# EAGLE design LoadSwitch (EAGLE 9.3.1)
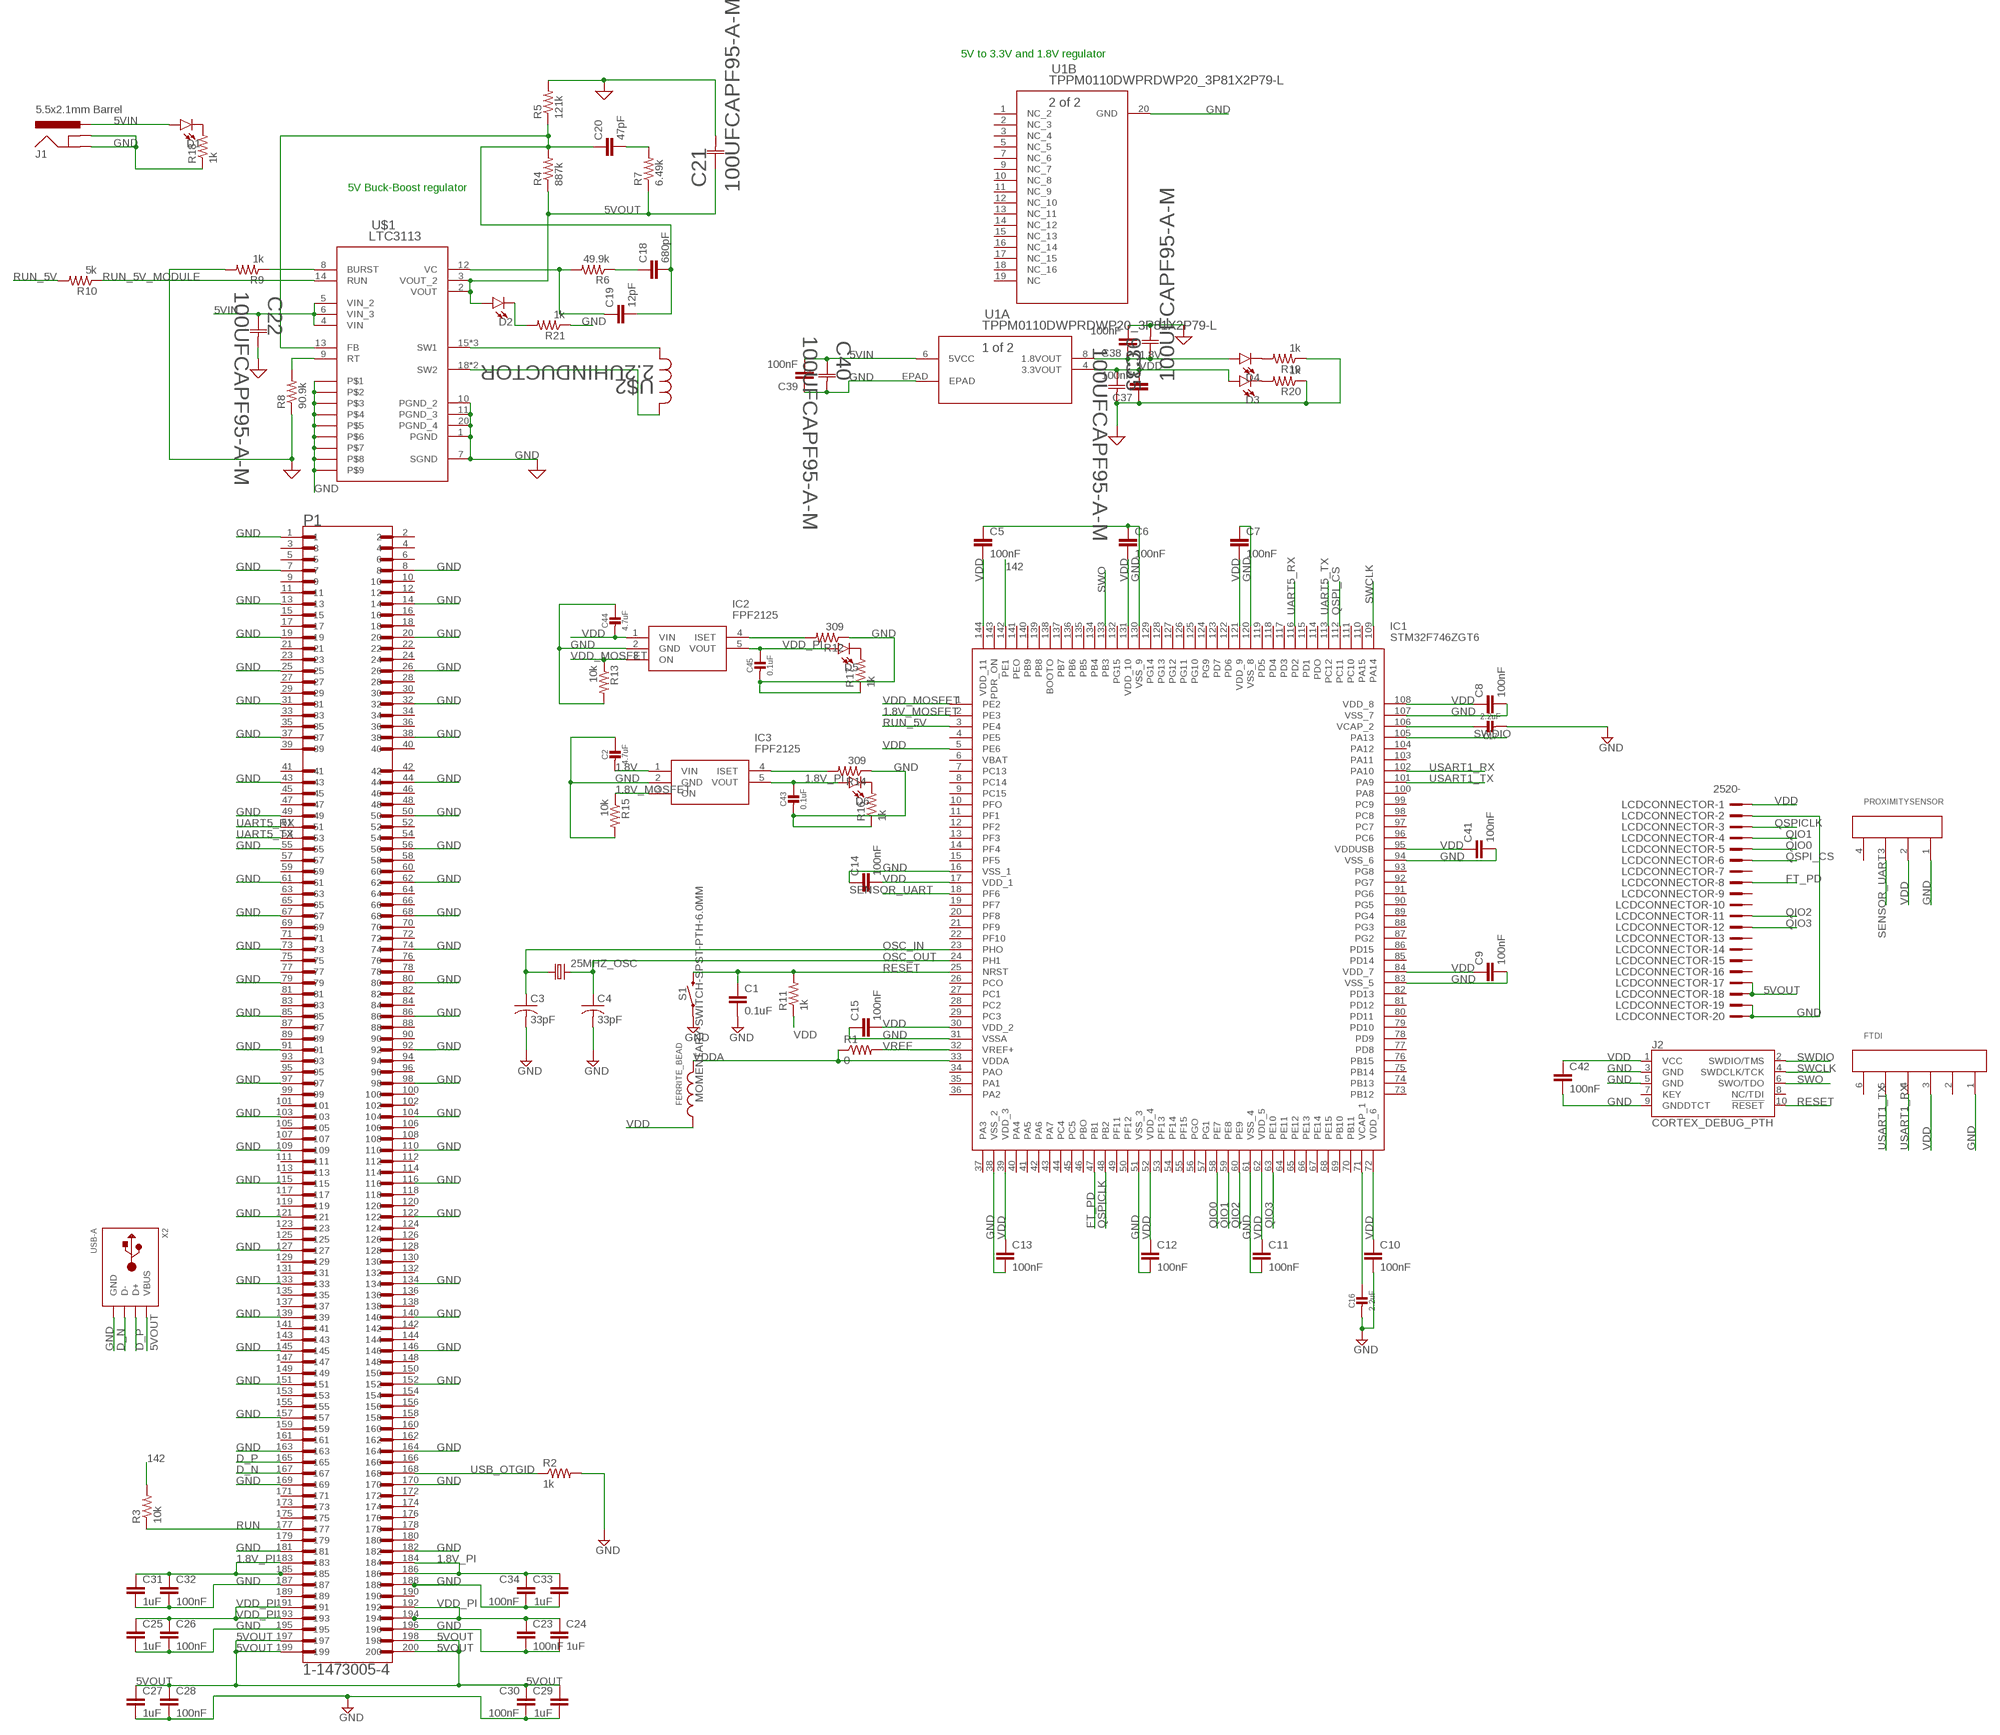
[diagram p0: schematic, sheet 1]

## Parts
25MHZ_OSC  CRYSTALHC49UP  [HC49UP]
C1  0.1uF  C-EUC0805  [C0805]
C2  4.7uF  CAP_CERAMIC0805-NOOUTLINE  [0805-NO]
C3  33pF  C-USC0805  [C0805]
C4  33pF  C-USC0805  [C0805]
C5  100nF  C-EUC0805  [C0805]
C6  100nF  C-EUC0805  [C0805]
C7  100nF  C-EUC0805  [C0805]
C8  100nF  C-EUC0805  [C0805]
C9  100nF  C-EUC0805  [C0805]
C10  100nF  C-EUC0805  [C0805]
C11  100nF  C-EUC0805  [C0805]
C12  100nF  C-EUC0805  [C0805]
C13  100nF  C-EUC0805  [C0805]
C14  100nF  C-EUC0805  [C0805]
C15  100nF  C-EUC0805  [C0805]
C16  2.2uF  CAP_CERAMIC0805-NOOUTLINE  [0805-NO]
C17  2.2uF  CAP_CERAMIC0805-NOOUTLINE  [0805-NO]
C18  680pF  C-EUC0805  [C0805]
C19  12pF  C-EUC0805  [C0805]
C20  47pF  C-EUC0805  [C0805]
C21  100UFCAPF95-A-M  [F95-A-M]
C22  100UFCAPF95-A-M  [F95-A-M]
C23  100nF  C-EUC0805  [C0805]
C24  1uF  C-EUC0805  [C0805]
C25  1uF  C-EUC0805  [C0805]
C26  100nF  C-EUC0805  [C0805]
C27  1uF  C-EUC0805  [C0805]
C28  100nF  C-EUC0805  [C0805]
C29  1uF  C-EUC0805  [C0805]
C30  100nF  C-EUC0805  [C0805]
C31  1uF  C-EUC0805  [C0805]
C32  100nF  C-EUC0805  [C0805]
C33  1uF  C-EUC0805  [C0805]
C34  100nF  C-EUC0805  [C0805]
C35  100UFCAPF95-A-M  [F95-A-M]
C36  100UFCAPF95-A-M  [F95-A-M]
C37  100nF  C-EUC0805  [C0805]
C38  100nF  C-EUC0805  [C0805]
C39  100nF  C-EUC0805  [C0805]
C40  100UFCAPF95-A-M  [F95-A-M]
C41  100nF  C-EUC0805  [C0805]
C42  100nF  C-EUC0805  [C0805]
C43  0.1uF  CAP_CERAMIC0805-NOOUTLINE  [0805-NO]
C44  4.7uF  CAP_CERAMIC0805-NOOUTLINE  [0805-NO]
C45  0.1uF  CAP_CERAMIC0805-NOOUTLINE  [0805-NO]
D1  LED0603  [LED-0603]
D2  LED0603  [LED-0603]
D3  LED0603  [LED-0603]
D4  LED0603  [LED-0603]
D5  LED0603  [LED-0603]
D6  LED0603  [LED-0603]
FERRITE_BEAD  WE-CBA_0805_782853112_HC  [WE-CBA_0805(W=4)]
FTDI  66100611622  [66100611622]
IC1  STM32F746ZGT6  [QFP50P2200X2200X160-144N]
IC2  FPF2125  [SOT95P280X140-5N]
IC3  FPF2125  [SOT95P280X140-5N]
J1  5.5x2.1mm Barrel  POWER_JACKSMD  [POWER_JACK_SMD]
J2  CORTEX_DEBUG_PTH  [2X5-PTH-1.27MM]
LCDCONNECTOR  2520-  [PAK100/2500-20]
P1  1-1473005-4  [TE_1-1473005-4]
PROXIMITYSENSOR  66100411622  [66100411622]
R1  0  R-US_R0805  [R0805]
R2  1k  R-US_R0805  [R0805]
R3  10k  R-US_R0805  [R0805]
R4  887k  R-US_R0805  [R0805]
R5  121k  R-US_R0805  [R0805]
R6  49.9k  R-US_R0805  [R0805]
R7  6.49k  R-US_R0805  [R0805]
R8  90.9k  R-US_R0805  [R0805]
R9  1k  R-US_R0805  [R0805]
R10  5k  R-US_R0805  [R0805]
R11  1k  R-US_R0805  [R0805]
R12  309  R-US_R0805  [R0805]
R13  10k  R-US_R0805  [R0805]
R14  309  R-US_R0805  [R0805]
R15  10k  R-US_R0805  [R0805]
R16  1k  R-US_R0805  [R0805]
R17  1k  R-US_R0805  [R0805]
R18  1k  R-US_R0805  [R0805]
R19  1k  R-US_R0805  [R0805]
R20  1k  R-US_R0805  [R0805]
R21  1k  R-US_R0805  [R0805]
S1  MOMENTARY-SWITCH-SPST-PTH-6.0MM  [TACTILE_SWITCH_PTH_6.0MM]
U1  TPPM0110DWPRDWP20_3P81X2P79-L  [DWP20_3P81X2P79-L]
U$1  LTC3113  [TSSOP-20_FE/CA]
U$2  2.2UHINDUCTOR  [IND_10040]
X2  USB-A  [MOLEX_480371000]

## Nets
1.8V: C2.2 C36.1 C38.1 D4.A IC3.1(VIN) U1.8(A:1.8VOUT)
1.8V_MOSFET: IC1.2(PE3) IC3.3(ON) R15.1
1.8V_PI: C31.1 C32.1 C33.1 C34.1 C43.1 D6.A IC3.5(VOUT) P1.183 P1.184 P1.185 P1.186
5VIN: C22.1 C39.2 C40.1 D1.A J1.VIN0(PWR) U1.6(A:5VCC) U$1.4(VIN) U$1.5(VIN_2) U$1.6(VIN_3)
5VOUT: C21.1 C27.1 C28.1 C29.1 C30.1 D2.A LCDCONNECTOR.17 LCDCONNECTOR.18 P1.197 P1.198 P1.199 P1.200 R4.1 R7.1 U$1.2(VOUT) U$1.3(VOUT_2) X2.1(VBUS)
142: IC1.142(PE1) R3.2
D_N [D]: P1.167 X2.2(D-)
D_P [D]: P1.165 X2.3(D+)
FT_PD: IC1.47(PB1) LCDCONNECTOR.8
GND: C1.2 C2.1 C3.2 C4.2 C5.1 C6.1 C7.1 C8.2 C9.2 C10.2 C11.2 C12.2 C13.2 C14.1 C15.1 C16.2 C17.2 C21.2 C22.2 C23.2 C24.2 C25.2 C26.2 C27.2 C28.2 C29.2 C30.2 C31.2 C32.2 C33.2 C34.2 C35.2 C36.2 C37.1 C38.2 C39.1 C40.2 C41.2 C42.2 C43.2 C44.1 C45.2 FTDI.1 IC1.16(VSS_1) IC1.31(VSSA) IC1.38(VSS_2) IC1.51(VSS_3) IC1.61(VSS_4) IC1.83(VSS_5) IC1.94(VSS_6) IC1.107(VSS_7) IC1.120(VSS_8) IC1.130(VSS_9) IC2.2(GND) IC3.2(GND) J1.GND(GNDBREAK) J1.P$4(GND) J2.3(GND) J2.5(GND) J2.9(GNDDTCT) LCDCONNECTOR.2 LCDCONNECTOR.19 LCDCONNECTOR.20 P1.1 P1.7 P1.8 P1.13 P1.14 P1.19 P1.20 P1.25 P1.26 P1.31 P1.32 P1.37 P1.38 P1.43 P1.44 P1.49 P1.50 P1.55 P1.56 P1.61 P1.62 P1.67 P1.68 P1.73 P1.74 P1.79 P1.80 P1.85 P1.86 P1.91 P1.92 P1.97 P1.98 P1.103 P1.104 P1.109 P1.110 P1.115 P1.116 P1.121 P1.122 P1.127 P1.133 P1.134 P1.139 P1.140 P1.145 P1.146 P1.151 P1.152 P1.157 P1.163 P1.164 P1.169 P1.170 P1.181 P1.182 P1.187 P1.188 P1.195 P1.196 PROXIMITYSENSOR.1 R2.2 R5.2 R8.1 R9.2 R12.1 R13.2 R14.1 R15.2 R16.1 R17.1 R18.1 R19.1 R20.1 R21.1 S1.1 U1.20(B:GND) U1.EPAD(A:EPAD) U$1.1(PGND) U$1.7(SGND) U$1.10(PGND_2) U$1.11(PGND_3) U$1.20(PGND_4) U$1.P$1 U$1.P$2 U$1.P$3 U$1.P$4 U$1.P$5 U$1.P$6 U$1.P$7 U$1.P$8 U$1.P$9 X2.4(GND) ; supply symbol labelled SUP
N$1: C16.1 IC1.71(VCAP_1)
N$2: C17.1 IC1.106(VCAP_2)
N$3: C20.2 R7.2
N$4: C19.1 R6.2 U$1.12(VC)
N$5: C18.1 R6.1
N$6: C18.2 C19.2 C20.1 R4.2 R5.1 U$1.13(FB)
N$7: U$1.15(SW1) U$1.16(SW1) U$1.17(SW1) U$2.2
N$8: U$1.18(SW2) U$1.19(SW2) U$2.1
N$9: R8.2 U$1.9(RT)
N$10: R9.1 U$1.8(BURST)
N$11: IC3.4(ISET) R14.2
N$12: D6.C R16.2
N$13: D5.C R17.2
N$14: IC2.4(ISET) R12.2
N$15: D1.C R18.2
N$16: D4.C R19.2
N$17: D3.C R20.2
N$18: D2.C R21.2
OSC_IN: 25MHZ_OSC.1 C3.1 IC1.23(PHO)
OSC_OUT: 25MHZ_OSC.2 C4.1 IC1.24(PH1)
QIO0: IC1.58(PE7) LCDCONNECTOR.5
QIO1: IC1.59(PE8) LCDCONNECTOR.4
QIO2: IC1.60(PE9) LCDCONNECTOR.11
QIO3: IC1.63(PE10) LCDCONNECTOR.12
QSPI_CS: IC1.112(PC11) LCDCONNECTOR.6
QSPICLK: IC1.48(PB2) LCDCONNECTOR.3
RESET: C1.1 IC1.25(NRST) J2.10(!RESET) R11.2 S1.3
RUN: P1.177 R3.1
RUN_5V: IC1.3(PE4) R10.2
RUN_5V_MODULE: R10.1 U$1.14(RUN)
SENSOR_UART: IC1.18(PF6) PROXIMITYSENSOR.3
SWCLK: IC1.109(PA14) J2.4(SWDCLK/TCK)
SWDIO: IC1.105(PA13) J2.2(SWDIO/TMS)
SWO: IC1.133(PB3) J2.6(SWO/TDO)
UART5_RX: IC1.116(PD2) P1.51
UART5_TX: IC1.113(PC12) P1.53
USART1_RX: FTDI.4 IC1.102(PA10)
USART1_TX: FTDI.5 IC1.101(PA9)
USB_OTGID: P1.168 R2.1
VDD: C5.2 C6.2 C7.2 C8.1 C9.1 C10.1 C11.1 C12.1 C13.1 C14.2 C15.2 C35.1 C37.2 C41.1 C42.1 C44.2 D3.A FERRITE_BEAD.1 FTDI.3 IC1.5(PE6) IC1.17(VDD_1) IC1.30(VDD_2) IC1.39(VDD_3) IC1.52(VDD_4) IC1.62(VDD_5) IC1.72(VDD_6) IC1.84(VDD_7) IC1.95(VDDUSB) IC1.108(VDD_8) IC1.121(VDD_9) IC1.131(VDD_10) IC1.144(VDD_11) IC2.1(VIN) J2.1(VCC) LCDCONNECTOR.1 PROXIMITYSENSOR.2 R11.1 U1.4(A:3.3VOUT)
VDD_MOSFET: IC1.1(PE2) IC2.3(ON) R13.1
VDD_PI: C23.1 C24.1 C25.1 C26.1 C45.1 D5.A IC2.5(VOUT) P1.191 P1.192 P1.193 P1.194
VDDA: FERRITE_BEAD.2 IC1.33(VDDA) R1.1
VREF: IC1.32(VREF+) R1.2
Unconnected: FTDI.2 FTDI.6 IC1.4(PE5) IC1.6(VBAT) IC1.7(PC13) IC1.8(PC14) IC1.9(PC15) IC1.10(PFO) IC1.11(PF1) IC1.12(PF2) IC1.13(PF3) IC1.14(PF4) IC1.15(PF5) IC1.19(PF7) IC1.20(PF8) IC1.21(PF9) IC1.22(PF10) IC1.26(PCO) IC1.27(PC1) IC1.28(PC2) IC1.29(PC3) IC1.34(PAO) IC1.35(PA1) IC1.36(PA2) IC1.37(PA3) IC1.40(PA4) IC1.41(PA5) IC1.42(PA6) IC1.43(PA7) IC1.44(PC4) IC1.45(PC5) IC1.46(PBO) IC1.49(PF11) IC1.50(PF12) IC1.53(PF13) IC1.54(PF14) IC1.55(PF15) IC1.56(PGO) IC1.57(PG1) IC1.64(PE11) IC1.65(PE12) IC1.66(PE13) IC1.67(PE14) IC1.68(PE15) IC1.69(PB10) IC1.70(PB11) IC1.73(PB12) IC1.74(PB13) IC1.75(PB14) IC1.76(PB15) IC1.77(PD8) IC1.78(PD9) IC1.79(PD10) IC1.80(PD11) IC1.81(PD12) IC1.82(PD13) IC1.85(PD14) IC1.86(PD15) IC1.87(PG2) IC1.88(PG3) IC1.89(PG4) IC1.90(PG5) IC1.91(PG6) IC1.92(PG7) IC1.93(PG8) IC1.96(PC6) IC1.97(PC7) IC1.98(PC8) IC1.99(PC9) IC1.100(PA8) IC1.103(PA11) IC1.104(PA12) IC1.110(PA15) IC1.111(PC10) IC1.114(PDO) IC1.115(PD1) IC1.117(PD3) IC1.118(PD4) IC1.119(PD5) IC1.122(PD6) IC1.123(PD7) IC1.124(PG9) IC1.125(PG10) IC1.126(PG11) IC1.127(PG12) IC1.128(PG13) IC1.129(PG14) IC1.132(PG15) IC1.134(PB4) IC1.135(PB5) IC1.136(PB6) IC1.137(PB7) IC1.138(BOOTO) IC1.139(PB8) IC1.140(PB9) IC1.141(PEO) IC1.143(PDR_ON) J2.7(KEY) J2.8(NC/TDI) LCDCONNECTOR.7 LCDCONNECTOR.9 LCDCONNECTOR.10 LCDCONNECTOR.13 LCDCONNECTOR.14 LCDCONNECTOR.15 LCDCONNECTOR.16 P1.2 P1.3 P1.4 P1.5 P1.6 P1.9 P1.10 P1.11 P1.12 P1.15 P1.16 P1.17 P1.18 P1.21 P1.22 P1.23 P1.24 P1.27 P1.28 P1.29 P1.30 P1.33 P1.34 P1.35 P1.36 P1.39 P1.40 P1.41 P1.42 P1.45 P1.46 P1.47 P1.48 P1.52 P1.54 P1.57 P1.58 P1.59 P1.60 P1.63 P1.64 P1.65 P1.66 P1.69 P1.70 P1.71 P1.72 P1.75 P1.76 P1.77 P1.78 P1.81 P1.82 P1.83 P1.84 P1.87 P1.88 P1.89 P1.90 P1.93 P1.94 P1.95 P1.96 P1.99 P1.100 P1.101 P1.102 P1.105 P1.106 P1.107 P1.108 P1.111 P1.112 P1.113 P1.114 P1.117 P1.118 P1.119 P1.120 P1.123 P1.124 P1.125 P1.126 P1.128 P1.129 P1.130 P1.131 P1.132 P1.135 P1.136 P1.137 P1.138 P1.141 P1.142 P1.143 P1.144 P1.147 P1.148 P1.149 P1.150 P1.153 P1.154 P1.155 P1.156 P1.158 P1.159 P1.160 P1.161 P1.162 P1.166 P1.171 P1.172 P1.173 P1.174 P1.175 P1.176 P1.178 P1.179 P1.180 P1.189 P1.190 PROXIMITYSENSOR.4 U1.1(B:NC_2) U1.2(B:NC_3) U1.3(B:NC_4) U1.5(B:NC_5) U1.7(B:NC_6) U1.9(B:NC_7) U1.10(B:NC_8) U1.11(B:NC_9) U1.12(B:NC_10) U1.13(B:NC_11) U1.14(B:NC_12) U1.15(B:NC_13) U1.16(B:NC_14) U1.17(B:NC_15) U1.18(B:NC_16) U1.19(B:NC)

## Notes on the sheet
- 5V to 3.3V and 1.8V regulator
- 5V Buck-Boost regulator

## Library data of the parts
25MHZ_OSC = adafruit:CRYSTAL: CRYSTAL; OC_FARNELL: unknown; OC_NEWARK: unknown
C1 C5-C15 C18-C20 C23-C34 C37-C39 C41 C42 = rcl:C-EU: CAPACITOR, European symbol; SPICEPREFIX: C
C2 C43-C45 = 477_LIBRARY:CAP_CERAMIC
C3 C4 = adafruit:C-US: CAPACITOR, American symbol
C16 C17 = audio amplifier example:CAP_CERAMIC
C21 C22 C35 C36 C40 = 477_LIBRARY:100UFCAP; MANUFACTURER_PART_NUMBER: F951A107KAAAQ2; VENDOR: AVX Corporation
D1-D6 = SparkFun-LED:LED: LED (Generic) Standard schematic elements and footprints for 5mm, 3mm, 1206, and 0603 sized LEDs. Generic LEDs with no color specified.
FERRITE_BEAD = Wurth_Elektronik_Passive_rev18f:WE-CBA_0805: WE-CBA SMD EMI Suppression Ferrite Bead Characteristics Reliable Ni-Sn electrodes High rated current up to 5A Recommended soldering: Reflow Operating temperature: -55°C to +125°C Applications * Perfect as data line filter and for uncoupling of distribution voltage *This special SMD chip bead ferrites can be put directly on the printed circuit board. They offer excellent anti-EMI properties and low DC-resistance. Placed very close next to the interference source even with smallest size 0402,maximal impedance at 1000 Ω can be reached. *High Speed: "High Speed " SMD ferrites WE-CBF have lower impedance in the lower frequency ranges thus they have only a low attenuation for fast signals. Application e.g. USB 2.0, IEEE 1394,LVDS *Wide Band: "Wide Band" SMD ferrites WE-CBF already show high impedance in low frequency range. Therefore they are wide band through the whole spectrum. Application e.g. control signats, RS232, RS422, DC/DC converter *High Current: "High Current " SMD ferrites WE-CBF are designed for high current (over 1 A). The rated current refers to 40K self-heating. High current SMD ferrites are available in all there types (High Speed, Wide Band and High Frequency). Application e.g. power supply, DC/DC converter *Advice: Pay attention for the use of SMD-Ferrites for high current>1A and ambient temperature over +85°C that the rated current has to be reduced when temperature is above +85°C (Derating). *At+100°C environment temperature the maximal rated current has to add up to only 60% of the data sheet value ,without an overload of the component. Variant abbreviation WB means WIDE BAND HS means HIGH SPEED HC means HIGH CURRENT <http://katalog.we-online.de/media/images/v2/Family_WE-CBA.jpg> Details see: http://katalog.we-online.de/en/pbs/WE-CBA/ Created: 2015-02-02 2015 (C) Wurth Elektronik
FTDI = Wurth_Elektronik_Electromechanic_Wire_to_Board_Connectors_rev18a:66100611622: WIRE TO BOARD CONNECTION - 2.54 MM - SHROUDED HEADER - STRAIGHT - GLOW WIRE PLASTIC - WR-WTB =>ConWTB254 661006116222 Characteristics INSULATOR: PA46G15 FLAMMABILITY RATING: UL94V0 COLOR: BLACK METAL: PHOSPHOR BRONZE PLATING: TIN OVER Ni QUALITY CLASS: 25 MATING CYCLES OPERATING TEMPERATURE:-40°C UP TO +125°C COMPLIANCE: LEAD FREE AND ROHS ELECTRICAL CURRENT RATING: 3 A WORKING VOLTAGE: 50 VAC WITHSTANDING VOLTAGE: 500 VAC/MIN INSULATION RESISTANCE: >1000 MΩ CONTACT RESISTANCE: 20 mΩ MAX <http://katalog.we-online.de/media/images/v2/Family_WR-WTB_6610xx11622_2%2054.jpg> Details see: http://katalog.we-online.de/en/em/WTB_2_54_MALE_HORIZONTAL_SHROUDED_HEADER_GLOW_WIRE_PLASTIC_6610XXX1622 2015 (C) Wurth Elektronik
IC1 = 477_LIBRARY:STM32F746ZGT6: ARM Microcontrollers - MCU High-performance and DSP with FPU, ARM Cortex-M7 MCU with 1 Mbytes Flash, 200 MHz CPU, Art Accelerator, L1 cache, SDRAM Source: Datasheet <http://docs-emea.rs-online.com/webdocs/13fb/0900766b813fbe9b.pdf>; DESCRIPTION: ARM Microcontrollers - MCU High-performance and DSP with FPU, ARM Cortex-M7 MCU with 1 Mbytes Flash, 200 MHz CPU, Art Accelerator, L1 cache, SDRAM; HEIGHT: 1.6mm; MANUFACTURER_NAME: STMicroelectronics; MANUFACTURER_PART_NUMBER: STM32F746ZGT6; MOUSER_PART_NUMBER: 511-STM32F746ZGT6; MOUSER_PRICE-STOCK: https://www.mouser.com/Search/Refine.aspx?Keyword=511-STM32F746ZGT6; RS_PART_NUMBER: 8820290; RS_PRICE-STOCK: http://uk.rs-online.com/web/p/products/8820290
IC2 IC3 = FPF2125:FPF2125: FPF2125, Intelligent Power Switch Load Management Switch, 1A, 5.5V, 5-Pin, SOT-23 Source: Datasheet <http://docs-emea.rs-online.com/webdocs/0f9b/0900766b80f9b08c.pdf>; DESCRIPTION: FPF2125, Intelligent Power Switch Load Management Switch, 1A, 5.5V, 5-Pin, SOT-23; HEIGHT: 1.4mm; MANUFACTURER_NAME: Fairchild Semiconductor; MANUFACTURER_PART_NUMBER: FPF2125; MOUSER_PART_NUMBER: 512-FPF2125; MOUSER_PRICE-STOCK: https://www.mouser.com/Search/Refine.aspx?Keyword=512-FPF2125; RS_PART_NUMBER: 7390195; RS_PRICE-STOCK: http://uk.rs-online.com/web/p/intelligent-power-switches/7390195/?source=DS
J1 = SparkFun-Connectors:POWER_JACK: Power Jack Connector This is the standard 5.5mm barrel jack for power. The PTH is the most common, proven, reliable, footprint. The Slot footprint only works if the mill layer is transmitted to the PCB fab house so be warned. Here are the connectors we sell at SparkFun: DC Barrel Power Jack/Connector <https://www.sparkfun.com/products/119> (PRT-00119) DC Barrel Power Jack/Connector (SMD) <https://www.sparkfun.com/products/12748> (PRT-12748) DC Barrel Jack Adapter - Breadboard Compatible <https://www.sparkfun.com/products/10811> (PRT-10811) It is used on this SparkFun product (and many, many others): SparkFun RedBoard - Programmed with Arduino <https://www.sparkfun.com/products/12757> (DEV-12757) Also, if you need a mating power supply or connector, please check these out: Wall Adapter Power Supply - 9VDC 650mA <https://www.sparkfun.com/products/298> (TOL-00298) DC Barrel Jack Adapter - Male <https://www.sparkfun.com/products/10287> (PRT-10287); PROD_ID: CONN-08106; SF_ID: PRT-12748
J2 = SparkFun-Connectors:CORTEX_DEBUG: Cortex Debug Connector - 10 pin Supports JTAG debug, Serial Wire debug, and Serial Wire Viewer. PTH and SMD connector options available. General Connector Information <http://infocenter.arm.com/help/topic/com.arm.doc.faqs/attached/13634/cortex_debug_connectors.pdf> Products: PTH Connector <http://www.digikey.com/product-detail/en/cnc-tech/3220-10-0100-00/1175-1627-ND/3883661> -via Digi-Key SparkFun PSoc <https://www.sparkfun.com/products/13229> SparkFun T <https://www.sparkfun.com/products/13810>
LCDCONNECTOR = con-3m:2520-: 3M (TM) Pak 100 4-Wall Header Source: 3M; OC_FARNELL: unknown; OC_NEWARK: unknown
P1 = Rpi-DDR2:1-1473005-4: Conn SO DIMM Socket SKT 200 POS 0.6mm Solder RA SMD Tray; AVAILABILITY: Unavailable; CENTERLINE_PITCH: .6 mm[.024 in]; COMMENT: 1-1473005-4; DESCRIPTION: SEMI-HARD TRAY DDR2 SODIMM SOCKET 200P 5; MF: TE Connectivity; MP: 1-1473005-4; NUMBER_OF_POSITIONS: 200; PACKAGE: None; PRICE: None; PRODUCT_TYPE: Socket; TE_PURCHASE_URL: https://www.te.com/usa-en/product-1-1473005-4.html?te_bu=Cor&te_type=disp&te_campaign=seda_glo_cor-seda-global-disp-prtnr-fy19-seda-model-bom-cta_sma-317_1&elqCampaignId=32493
PROXIMITYSENSOR = Wurth_Elektronik_Electromechanic_Wire_to_Board_Connectors_rev18a:66100411622: WIRE TO BOARD CONNECTION - 2.54 MM - SHROUDED HEADER - STRAIGHT - GLOW WIRE PLASTIC - WR-WTB =>ConWTB254 661004116222 Characteristics INSULATOR: PA46G15 FLAMMABILITY RATING: UL94V0 COLOR: BLACK METAL: PHOSPHOR BRONZE PLATING: TIN OVER Ni QUALITY CLASS: 25 MATING CYCLES OPERATING TEMPERATURE:-40°C UP TO +125°C COMPLIANCE: LEAD FREE AND ROHS ELECTRICAL CURRENT RATING: 3 A WORKING VOLTAGE: 50 VAC WITHSTANDING VOLTAGE: 500 VAC/MIN INSULATION RESISTANCE: >1000 MΩ CONTACT RESISTANCE: 20 mΩ MAX <http://katalog.we-online.de/media/images/v2/Family_WR-WTB_6610xx11622_2%2054.jpg> Details see: http://katalog.we-online.de/en/em/WTB_2_54_MALE_HORIZONTAL_SHROUDED_HEADER_GLOW_WIRE_PLASTIC_6610XXX1622 2015 (C) Wurth Elektronik
R1-R3 R11-R21 = audio amplifier example:R-US_: RESISTOR, American symbol
R4-R10 = resistor:R-US_: RESISTOR, American symbol
S1 = SparkFun-Switches:MOMENTARY-SWITCH-SPST: Momentary Switch (Pushbutton) - SPST Normally-open (NO) SPST momentary switches (buttons, pushbuttons). Variants PTH-12MM - 12mm square, through-hole Momentary Pushbutton Switch - 12mm Square <https://www.sparkfun.com/products/9190> (COM-09190) PTH-6.0MM, PTH-6.0MM-KIT - 6.0mm square, through-hole Mini Pushbutton Switch <https://www.sparkfun.com/products/97> (COM-00097) KIT package intended for soldering kit's - only one side of pads' copper is exposed. PTH-RIGHT-ANGLE-KIT - Right-angle, through-hole Right Angle Tactile Button <https://www.sparkfun.com/products/10791> - Used on SparkFun BigTime Watch Kit <https://www.sparkfun.com/products/11734> SMD-12MM - 12mm square, surface-mount Tactile Button - SMD (12mm) <https://www.sparkfun.com/products/12993> (COM-12993) Used on SparkFun PicoBoard <https://www.sparkfun.com/products/11888> SMD-4.5MM - 4.5mm Square Trackball Switch Used on SparkFun Blackberry Trackballer Breakout <https://www.sparkfun.com/products/13169> SMD-4.6MMX2.8MM - 4.60mm x 2.80mm, surface mount Used on SparkFun SAMD21 Mini Breakout <https://www.sparkfun.com/products/13664> SMD-5.2MM, SMD-5.2-REDUNDANT - 5.2mm square, surface-mount Mini Pushbutton Switch - SMD <https://www.sparkfun.com/products/8720> (COM-08720) Used on Arduino Pro Mini <https://www.sparkfun.com/products/11114> REDUNDANT package connects both switch circuits together SMD-6.0X3.5MM - 6.0 x 3.5mm, surface mount Momentary Reset Switch SMD <https://www.sparkfun.com/products/8229> (COM-08229) SMD-6.2MM-TALL - 6.2mm square, surface mount Tactile Button - SMD (6mm) <https://www.sparkfun.com/products/12992> Used on SparkFun Digital Sandbox <https://www.sparkfun.com/products/12651> SMD-RIGHT-ANGLE - Right-angle, surface mount Used on SparkFun Block for Intel® Edison - Arduino <https://www.sparkfun.com/products/13036>; PROD_ID: SWCH-08441; SF_SKU: COM-00097
U1 = 477_LIBRARY:TPPM0110DWPR; MANUFACTURER_PART_NUMBER: TPPM0110DWPR; VENDOR: Texas Instruments
U$1 = 477_LIBRARY:LTC3113
U$2 = 477_LIBRARY:2.2UHINDUCTOR
X2 = adafruit:USB-A: USB type A 'plug' Used for things that can directly connect to a USB port, say USB key

## Net classes
1 D: width 0.203 mm

## Board
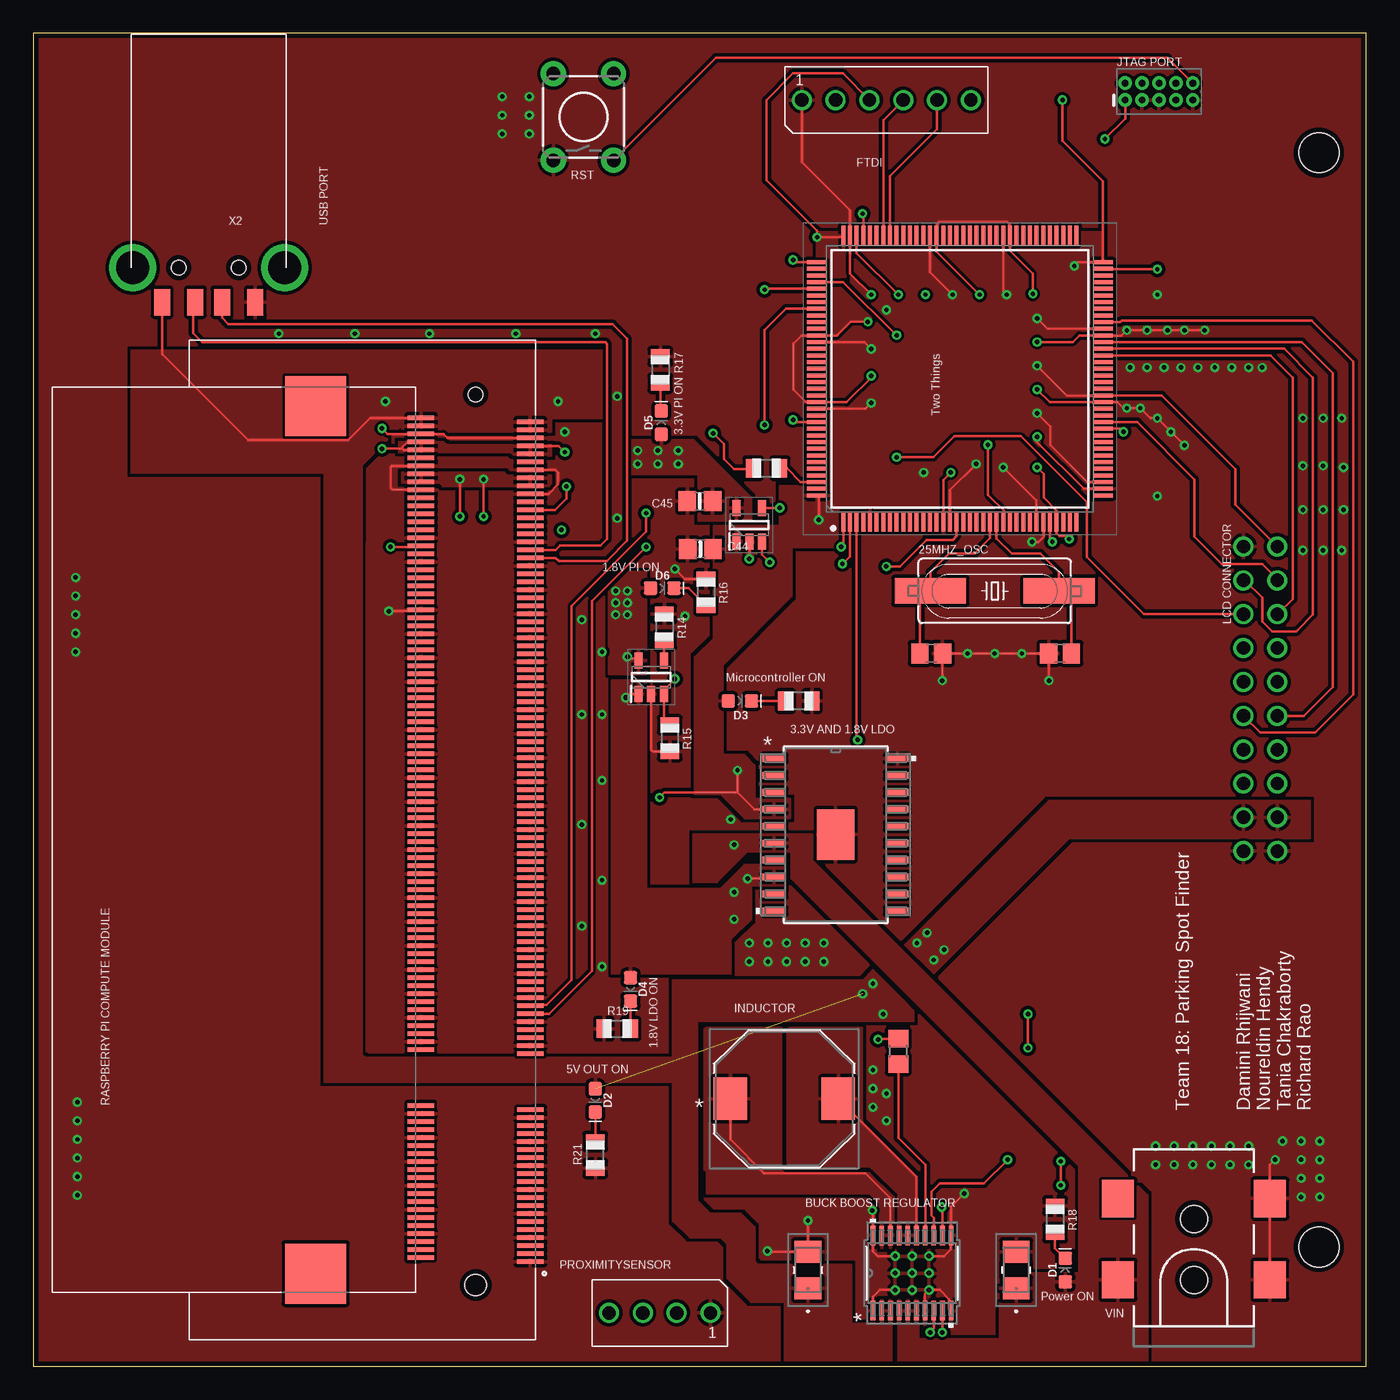
[diagram p1: board, top side]
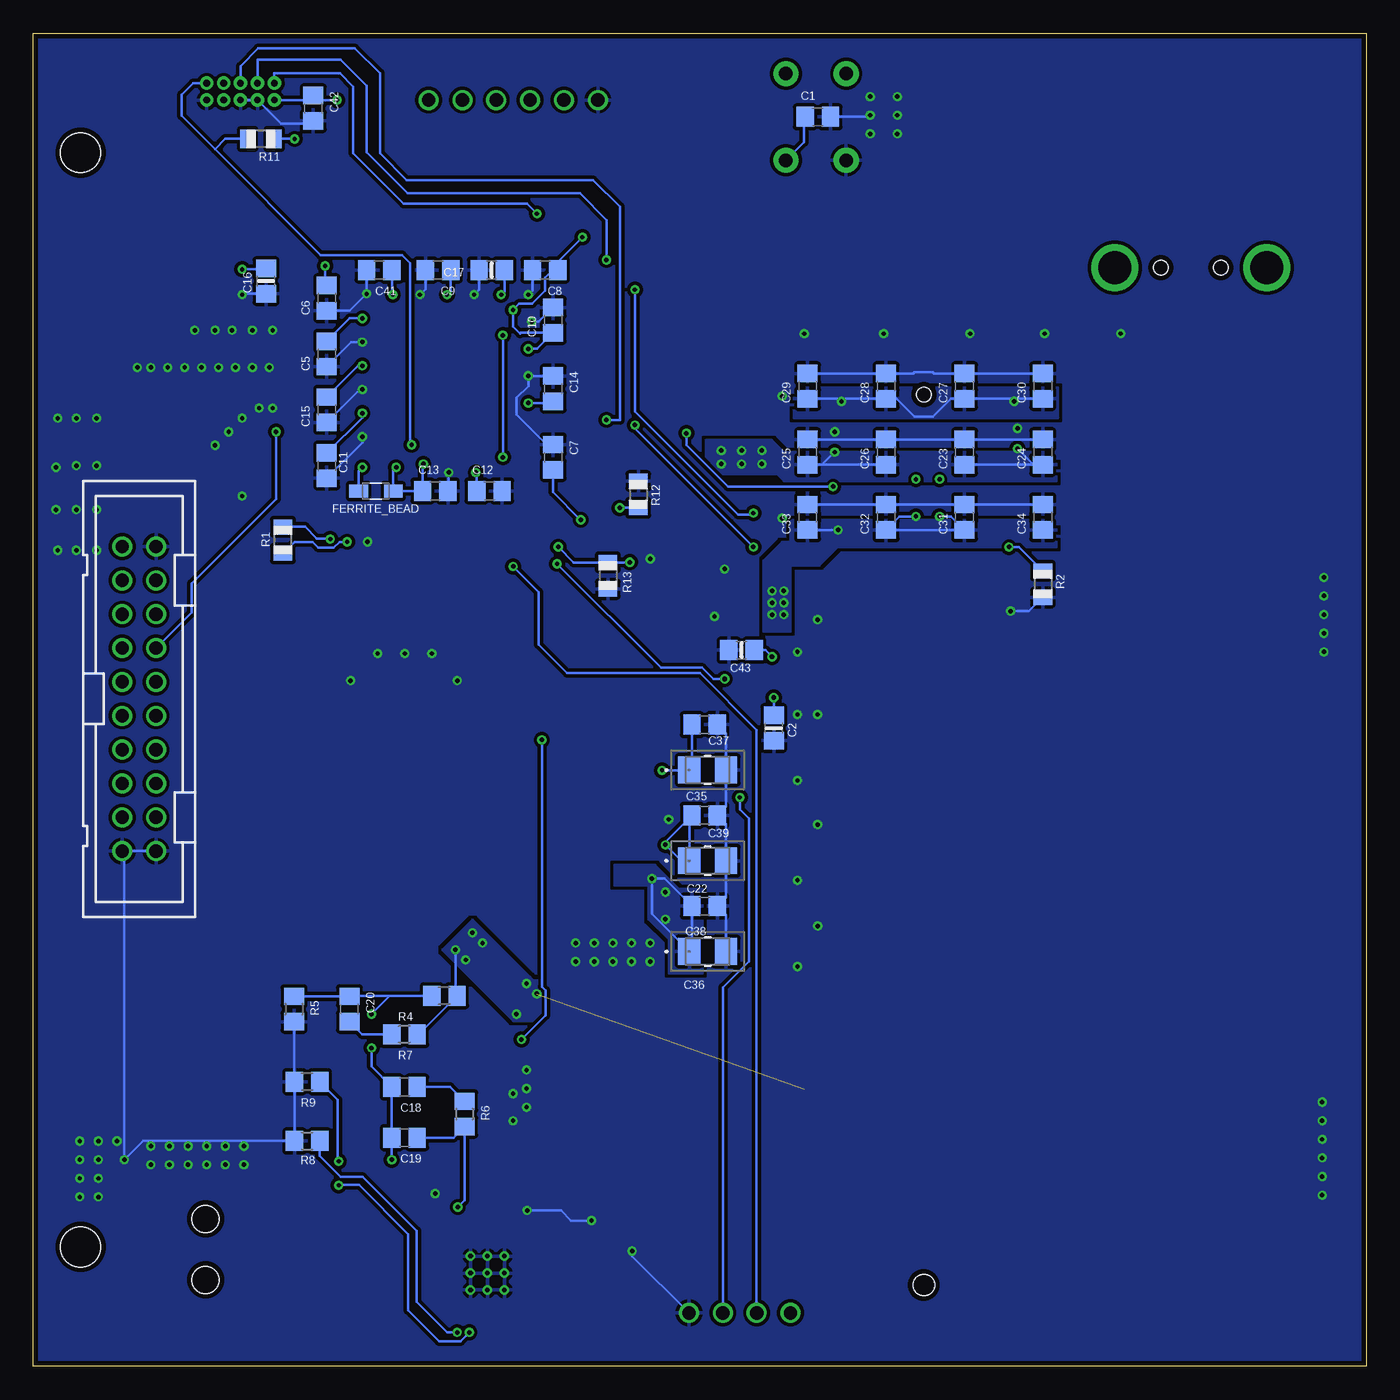
[diagram p2: board, bottom side, seen from below]

Size 100 x 100 mm. Coordinates in mm from the lower left corner, seen from the top.
Outline: 0,0 100,0 100,100 0,100 0,0
Copper layers (1*16): Top 0.0356mm / dielectric 1.5011mm / Bottom 0.0356mm
Design rules "ECE_Senior_Design": minimum track width 8mil, minimum drill 13mil, track to track 8mil, track to pad 8mil, pad to pad 6mil, via to via 8mil, smd to smd 6mil, copper to edge 15mil, drill to drill 8mil, minimum pad ring 7mil, minimum via ring 7mil, stop-mask expansion 3mil, vias tented up to drill 0mil, thermal gap 10mil
Holes 3 mm at 96.45,8.95 96.45,91.05

### Footprints (pad centres in the part's own frame; a part is rotated, then mirrored left to right if it is on the bottom)
HC49UP = smd 5.334 x 1.93: 1 -4.826,0; 2 4.826,0
C0805 = smd 1.3 x 1.5: 1 -0.95,0; 2 0.95,0
0805-NO = smd 1.3 x 1.5: 1 -0.95,0; 2 0.95,0
C0805' = smd 1.3 x 1.5: 1 -0.85,0; 2 0.85,0
F95-A-M = smd 1.651 x 2.007: 1 -1.384,0; 2 1.384,0
LED-0603 = smd 1 x 1: A -0.877,0; C 0.877,0
WE-CBA_0805(W=4) = smd 1.4 x 1: 1 -1.3,0; 2 1.3,0
66100611622 = drill 1: 1 6.35,0; 2 3.81,0; 3 1.27,0; 4 -1.27,0; 5 -3.81,0; 6 -6.35,0
QFP50P2200X2200X160-144N = smd 1.475 x 0.3: 1 -10.738,8.75; 2 -10.738,8.25; 3 -10.738,7.75; 4 -10.738,7.25; 5 -10.738,6.75; 6 -10.738,6.25; 7 -10.738,5.75; 8 -10.738,5.25; 9 -10.738,4.75; 10 -10.738,4.25; 11 -10.738,3.75; 12 -10.738,3.25; 13 -10.738,2.75; 14 -10.738,2.25; 15 -10.738,1.75; 16 -10.738,1.25; 17 -10.738,0.75; 18 -10.738,0.25; 19 -10.738,-0.25; 20 -10.738,-0.75; 21 -10.738,-1.25; 22 -10.738,-1.75; 23 -10.738,-2.25; 24 -10.738,-2.75; 25 -10.738,-3.25; 26 -10.738,-3.75; 27 -10.738,-4.25; 28 -10.738,-4.75; 29 -10.738,-5.25; 30 -10.738,-5.75; 31 -10.738,-6.25; 32 -10.738,-6.75; 33 -10.738,-7.25; 34 -10.738,-7.75; 35 -10.738,-8.25; 36 -10.738,-8.75; 73 10.738,-8.75; 74 10.738,-8.25; 75 10.738,-7.75; 76 10.738,-7.25; 77 10.738,-6.75; 78 10.738,-6.25; 79 10.738,-5.75; 80 10.738,-5.25; 81 10.738,-4.75; 82 10.738,-4.25; 83 10.738,-3.75; 84 10.738,-3.25; 85 10.738,-2.75; 86 10.738,-2.25; 87 10.738,-1.75; 88 10.738,-1.25; 89 10.738,-0.75; 90 10.738,-0.25; 91 10.738,0.25; 92 10.738,0.75; 93 10.738,1.25; 94 10.738,1.75; 95 10.738,2.25; 96 10.738,2.75; 97 10.738,3.25; 98 10.738,3.75; 99 10.738,4.25; 100 10.738,4.75; 101 10.738,5.25; 102 10.738,5.75; 103 10.738,6.25; 104 10.738,6.75; 105 10.738,7.25; 106 10.738,7.75; 107 10.738,8.25; 108 10.738,8.75 | smd 0.3 x 1.475: 37 -8.75,-10.738; 38 -8.25,-10.738; 39 -7.75,-10.738; 40 -7.25,-10.738; 41 -6.75,-10.738; 42 -6.25,-10.738; 43 -5.75,-10.738; 44 -5.25,-10.738; 45 -4.75,-10.738; 46 -4.25,-10.738; 47 -3.75,-10.738; 48 -3.25,-10.738; 49 -2.75,-10.738; 50 -2.25,-10.738; 51 -1.75,-10.738; 52 -1.25,-10.738; 53 -0.75,-10.738; 54 -0.25,-10.738; 55 0.25,-10.738; 56 0.75,-10.738; 57 1.25,-10.738; 58 1.75,-10.738; 59 2.25,-10.738; 60 2.75,-10.738; 61 3.25,-10.738; 62 3.75,-10.738; 63 4.25,-10.738; 64 4.75,-10.738; 65 5.25,-10.738; 66 5.75,-10.738; 67 6.25,-10.738; 68 6.75,-10.738; 69 7.25,-10.738; 70 7.75,-10.738; 71 8.25,-10.738; 72 8.75,-10.738; 109 8.75,10.738; 110 8.25,10.738; 111 7.75,10.738; 112 7.25,10.738; 113 6.75,10.738; 114 6.25,10.738; 115 5.75,10.738; 116 5.25,10.738; 117 4.75,10.738; 118 4.25,10.738; 119 3.75,10.738; 120 3.25,10.738; 121 2.75,10.738; 122 2.25,10.738; 123 1.75,10.738; 124 1.25,10.738; 125 0.75,10.738; 126 0.25,10.738; 127 -0.25,10.738; 128 -0.75,10.738; 129 -1.25,10.738; 130 -1.75,10.738; 131 -2.25,10.738; 132 -2.75,10.738; 133 -3.25,10.738; 134 -3.75,10.738; 135 -4.25,10.738; 136 -4.75,10.738; 137 -5.25,10.738; 138 -5.75,10.738; 139 -6.25,10.738; 140 -6.75,10.738; 141 -7.25,10.738; 142 -7.75,10.738; 143 -8.25,10.738; 144 -8.75,10.738
SOT95P280X140-5N = smd 1.2 x 0.6: 1 -1.25,0.95; 2 -1.25,0; 3 -1.25,-0.95; 4 1.25,-0.95; 5 1.25,0.95
POWER_JACK_SMD = smd 2.8 x 2.4: GND 0,-5.7; P$4 6.1,-5.7; VIN0 0,5.7; VIN1 6.1,5.7 | hole 2.032: 0,0; 4.572,0
2X5-PTH-1.27MM = drill 0.508 pad 1: 1 -2.54,-0.635; 2 -2.54,0.635; 3 -1.27,-0.635; 4 -1.27,0.635; 5 0,-0.635; 6 0,0.635; 7 1.27,-0.635; 8 1.27,0.635; 9 2.54,-0.635; 10 2.54,0.635
PAK100/2500-20 = drill 1 pad 1.422: 1 -11.43,-1.27; 2 -11.43,1.27; 3 -8.89,-1.27; 4 -8.89,1.27; 5 -6.35,-1.27; 6 -6.35,1.27; 7 -3.81,-1.27; 8 -3.81,1.27; 9 -1.27,-1.27; 10 -1.27,1.27; 11 1.27,-1.27; 12 1.27,1.27; 13 3.81,-1.27; 14 3.81,1.27; 15 6.35,-1.27; 16 6.35,1.27; 17 8.89,-1.27; 18 8.89,1.27; 19 11.43,-1.27; 20 11.43,1.27
TE_1-1473005-4 = smd 2 x 0.35: 1 -4.1,31.65; 2 4.1,31.35; 3 -4.1,31.05; 4 4.1,30.75; 5 -4.1,30.45; 6 4.1,30.15; 7 -4.1,29.85; 8 4.1,29.55; 9 -4.1,29.25; 10 4.1,28.95; 11 -4.1,28.65; 12 4.1,28.35; 13 -4.1,28.05; 14 4.1,27.75; 15 -4.1,27.45; 16 4.1,27.15; 17 -4.1,26.85; 18 4.1,26.55; 19 -4.1,26.25; 20 4.1,25.95; 21 -4.1,25.65; 22 4.1,25.35; 23 -4.1,25.05; 24 4.1,24.75; 25 -4.1,24.45; 26 4.1,24.15; 27 -4.1,23.85; 28 4.1,23.55; 29 -4.1,23.25; 30 4.1,22.95; 31 -4.1,22.65; 32 4.1,22.35; 33 -4.1,22.05; 34 4.1,21.75; 35 -4.1,21.45; 36 4.1,21.15; 37 -4.1,20.85; 38 4.1,20.55; 39 -4.1,20.25; 40 4.1,19.95; 41 -4.1,16.05; 42 4.1,15.75; 43 -4.1,15.45; 44 4.1,15.15; 45 -4.1,14.85; 46 4.1,14.55; 47 -4.1,14.25; 48 4.1,13.95; 49 -4.1,13.65; 50 4.1,13.35; 51 -4.1,13.05; 52 4.1,12.75; 53 -4.1,12.45; 54 4.1,12.15; 55 -4.1,11.85; 56 4.1,11.55; 57 -4.1,11.25; 58 4.1,10.95; 59 -4.1,10.65; 60 4.1,10.35; 61 -4.1,10.05; 62 4.1,9.75; 63 -4.1,9.45; 64 4.1,9.15; 65 -4.1,8.85; 66 4.1,8.55; 67 -4.1,8.25; 68 4.1,7.95; 69 -4.1,7.65; 70 4.1,7.35; 71 -4.1,7.05; 72 4.1,6.75; 73 -4.1,6.45; 74 4.1,6.15; 75 -4.1,5.85; 76 4.1,5.55; 77 -4.1,5.25; 78 4.1,4.95; 79 -4.1,4.65; 80 4.1,4.35; 81 -4.1,4.05; 82 4.1,3.75; 83 -4.1,3.45; 84 4.1,3.15; 85 -4.1,2.85; 86 4.1,2.55; 87 -4.1,2.25; 88 4.1,1.95; 89 -4.1,1.65; 90 4.1,1.35; 91 -4.1,1.05; 92 4.1,0.75; 93 -4.1,0.45; 94 4.1,0.15; 95 -4.1,-0.15; 96 4.1,-0.45; 97 -4.1,-0.75; 98 4.1,-1.05; 99 -4.1,-1.35; 100 4.1,-1.65; 101 -4.1,-1.95; 102 4.1,-2.25; 103 -4.1,-2.55; 104 4.1,-2.85; 105 -4.1,-3.15; 106 4.1,-3.45; 107 -4.1,-3.75; 108 4.1,-4.05; 109 -4.1,-4.35; 110 4.1,-4.65; 111 -4.1,-4.95; 112 4.1,-5.25; 113 -4.1,-5.55; 114 4.1,-5.85; 115 -4.1,-6.15; 116 4.1,-6.45; 117 -4.1,-6.75; 118 4.1,-7.05; 119 -4.1,-7.35; 120 4.1,-7.65; 121 -4.1,-7.95; 122 4.1,-8.25; 123 -4.1,-8.55; 124 4.1,-8.85; 125 -4.1,-9.15; 126 4.1,-9.45; 127 -4.1,-9.75; 128 4.1,-10.05; 129 -4.1,-10.35; 130 4.1,-10.65; 131 -4.1,-10.95; 132 4.1,-11.25; 133 -4.1,-11.55; 134 4.1,-11.85; 135 -4.1,-12.15; 136 4.1,-12.45; 137 -4.1,-12.75; 138 4.1,-13.05; 139 -4.1,-13.35; 140 4.1,-13.65; 141 -4.1,-13.95; 142 4.1,-14.25; 143 -4.1,-14.55; 144 4.1,-14.85; 145 -4.1,-15.15; 146 4.1,-15.45; 147 -4.1,-15.75; 148 4.1,-16.05; 149 -4.1,-16.35; 150 4.1,-16.65; 151 -4.1,-16.95; 152 4.1,-17.25; 153 -4.1,-17.55; 154 4.1,-17.85; 155 -4.1,-18.15; 156 4.1,-18.45; 157 -4.1,-18.75; 158 4.1,-19.05; 159 -4.1,-19.35; 160 4.1,-19.65; 161 -4.1,-19.95; 162 4.1,-20.25; 163 -4.1,-20.55; 164 4.1,-20.85; 165 -4.1,-21.15; 166 4.1,-21.45; 167 -4.1,-21.75; 168 4.1,-22.05; 169 -4.1,-22.35; 170 4.1,-22.65; 171 -4.1,-22.95; 172 4.1,-23.25; 173 -4.1,-23.55; 174 4.1,-23.85; 175 -4.1,-24.15; 176 4.1,-24.45; 177 -4.1,-24.75; 178 4.1,-25.05; 179 -4.1,-25.35; 180 4.1,-25.65; 181 -4.1,-25.95; 182 4.1,-26.25; 183 -4.1,-26.55; 184 4.1,-26.85; 185 -4.1,-27.15; 186 4.1,-27.45; 187 -4.1,-27.75; 188 4.1,-28.05; 189 -4.1,-28.35; 190 4.1,-28.65; 191 -4.1,-28.95; 192 4.1,-29.25; 193 -4.1,-29.55; 194 4.1,-29.85; 195 -4.1,-30.15; 196 4.1,-30.45; 197 -4.1,-30.75; 198 4.1,-31.05; 199 -4.1,-31.35; 200 4.1,-31.65 | smd 4.6 x 4.5: P1 12,32.55; P2 12,-32.55 | hole 1.6: 0,33.4 | hole 1.1: 0,-33.4
66100411622 = drill 1: 1 3.81,0; 2 1.27,0; 3 -1.27,0; 4 -3.81,0
R0805 = smd 1.1 x 1.4: 1 -1,0; 2 1,0
R0805' = smd 1.3 x 1.5: 1 -0.95,0; 2 0.95,0
TACTILE_SWITCH_PTH_6.0MM = drill 1.016 pad 1.88: 1 -3.251,2.261; 2 3.251,2.261; 3 -3.251,-2.261; 4 3.251,-2.261
DWP20_3P81X2P79-L = smd 1.676 x 0.508: 1 -4.636,5.715; 2 -4.636,4.445; 3 -4.636,3.175; 4 -4.636,1.905; 5 -4.636,0.635; 6 -4.636,-0.635; 7 -4.636,-1.905; 8 -4.636,-3.175; 9 -4.636,-4.445; 10 -4.636,-5.715; 11 4.636,-5.715; 12 4.636,-4.445; 13 4.636,-3.175; 14 4.636,-1.905; 15 4.636,-0.635; 16 4.636,0.635; 17 4.636,1.905; 18 4.636,3.175; 19 4.636,4.445; 20 4.636,5.715 | smd 2.79 x 3.81: EPAD 0,0
TSSOP-20_FE/CA = smd 1.473 x 0.356: 1 -2.819,2.926; 2 -2.819,2.276; 3 -2.819,1.626; 4 -2.819,0.975; 5 -2.819,0.325; 6 -2.819,-0.325; 7 -2.819,-0.975; 8 -2.819,-1.626; 9 -2.819,-2.276; 10 -2.819,-2.926; 11 2.819,-2.926; 12 2.819,-2.276; 13 2.819,-1.626; 14 2.819,-0.975; 15 2.819,-0.325; 16 2.819,0.325; 17 2.819,0.975; 18 2.819,1.626; 19 2.819,2.276; 20 2.819,2.926 | drill 0.35: P$1 -1.27,1.27; P$2 0,1.27; P$3 1.27,1.27; P$4 -1.27,0; P$5 0,0; P$6 1.27,0; P$7 -1.27,-1.27; P$8 0,-1.27; P$9 1.27,-1.27
IND_10040 = smd 2.5 x 3.2: 1 -4.05,0; 2 4.05,0
MOLEX_480371000 = smd 1.2 x 2: 1 3.5,2.6; 2 1,2.6; 3 -1,2.6; 4 -3.5,2.6 | drill 2.5: M1 -5.7,0; M2 5.7,0 | hole 1.1: -2.25,0; 2.25,0

### Placement (x,y rotation side)
25MHZ_OSC  72.14,58.17 0 top
C1  41.15,93.73 0 bottom
C2  44.45,47.88 90 bottom
C3  33pF  [C0805']  67.37,53.48 0 top
C4  33pF  [C0805']  77.03,53.48 180 top
C5  77.98,75.95 90 bottom
C6  77.98,80.14 90 bottom
C7  61,68.2 270 bottom
C8  61.59,82.23 180 bottom
C9  69.63,82.23 180 bottom
C10  61,78.49 90 bottom
C11  77.98,67.56 270 bottom
C12  65.79,65.66 0 bottom
C13  69.84,65.66 0 bottom
C14  61,73.34 270 bottom
C15  77.98,71.75 90 bottom
C16  82.55,81.41 270 bottom
C17  65.61,82.23 180 bottom
C18  72.15,20.95 180 bottom
C19  72.15,17.14 180 bottom
C20  76.28,26.8 270 bottom
C21  58.12,7.21 90 top
C22  49.4,37.92 0 bottom
C23  30.14,68.58 90 bottom
C24  24.26,68.58 90 bottom
C25  41.91,68.58 90 bottom
C26  36.03,68.58 90 bottom
C27  30.14,73.53 90 bottom
C28  36.03,73.53 90 bottom
C29  41.91,73.53 90 bottom
C30  24.26,73.53 90 bottom
C31  30.14,63.69 90 bottom
C32  36.03,63.69 90 bottom
C33  41.91,63.69 90 bottom
C34  24.26,63.69 90 bottom
C35  49.4,44.73 0 bottom
C36  49.4,31.11 0 bottom
C37  49.63,48.13 180 bottom
C38  49.63,34.52 0 bottom
C39  49.63,41.33 180 bottom
C40  73.74,7.21 90 top
C41  74.04,82.23 180 bottom
C42  78.99,94.38 270 bottom
C43  46.86,53.72 180 bottom
C44  50.04,61.32 0 top
C45  50.01,64.9 180 top
D1  77.42,7.21 90 top
D2  42.16,19.94 270 top
D3  53.01,49.91 0 top
D4  44.81,28.27 270 top
D5  47.12,70.79 90 top
D6  47.19,58.37 0 top
DRILEGEND  [DRILEGEND]  15.14,-42.1 0 top  (outside the outline)
FERRITE_BEAD  74.3,65.66 180 bottom
FTDI  64,95 180 top
IC1  69.52,74.08 90 top
IC2  53.72,63.12 90 top
IC3  46.35,51.69 90 top
J1  87.07,6.48 90 top
J2  84.45,95.63 0 top
LCDCONNECTOR  92.06,50.07 270 bottom
P1  33.19,39.5 180 top
PROXIMITYSENSOR  47,4 0 top
R1  81.28,61.98 270 bottom
R2  24.26,58.67 270 bottom
R3  55.01,67.37 0 top
R4  887k  [R0805']  69.15,27.79 180 bottom
R5  121k  [R0805']  80.44,26.8 270 bottom
R6  49.9k  [R0805']  67.64,18.92 270 bottom
R7  6.49k  [R0805']  72.15,24.89 180 bottom
R8  90.9k  [R0805']  79.45,16.89 0 bottom
R9  1k  [R0805']  79.45,21.34 180 bottom
R10  5k  [R0805']  64.9,23.62 90 top
R11  82.93,92.08 180 bottom
R12  54.61,65.41 270 bottom
R13  56.9,59.31 270 bottom
R14  47.35,55.45 270 top
R15  47.75,47.12 270 top
R16  50.47,58.06 270 top
R17  47.04,74.75 270 top
R18  76.66,11.02 270 top
R19  43.81,25.32 0 top
R20  57.43,49.91 180 top
R21  42.16,15.85 90 top
S1  41.27,93.73 90 top
U1  60.2,39.88 0 top
U$1  65.93,6.99 90 top
U$2  56.34,20.07 0 top
X2  13.16,82.42 180 top

### Tracks (layer width: path | path; a pad name or v marks a point on that pad's centre or on a via)
1.8V  (via drill 0.33, 0.33 pad 0.55, 0.35)
  Top 0.203: v53.59,36.58 55.44,36.58 U1.8 | IC3.1 44.72,50.44 v44.45,50.16
  Bottom 0.203: v44.45,50.16 C2.2 | C36.1 50.58,31.32 C38.1 52.64,36.58 v53.59,36.58 53.59,33.92 C36.1
  other vias: 52.58,35.56 52.58,33.53
  pour Top: 53.34,37.59 56.39,37.59 56.39,36.07 53.85,36.07 53.85,33.53 52.32,32 52.32,29.46 43.43,29.46 43.43,35.81 51.56,35.81
  pour Bottom: 49.78,35.81 49.78,29.46 52.32,29.46 52.32,32 53.85,33.53 53.85,36.07 56.39,36.07 56.39,37.59 53.34,37.59 51.56,35.81
  pour Top (rank 2): 43.43,35.31 43.43,51.44 45.97,51.44 45.97,35.31
1.8V_MOSFET  (via drill 0.33, 0.35)
  Top 0.203: IC1.2 61.27,60.76 v60.71,60.2 | v48.13,51.56 47.3,50.73 IC3.3 47.3,48.56 R15.1
  Bottom 0.203: v60.71,60.2 52.91,52.41 49.83,52.41 48.99,51.56 v48.13,51.56
1.8V_PI  (via drill 0.33, 0.33 pad 0.55, 0.35)
  Top 0.203: v32,63.75 v32,66.55 | v33.78,63.75 v33.78,66.55 | IC3.5 45.41,53.09 44.7,53.09 v44.58,53.21
  Bottom 0.203: v32,63.75 31.15,63.75 C31.1 C32.1 35.01,63.75 v33.78,63.75 | v39.62,62.74 C33.1 | C43.1 45.09,53.72 v44.58,53.21
  other vias: 43.69,58.17 44.58,58.17 44.58,57.28 43.69,57.28 43.69,56.39 44.58,56.39
  pour Top: 27.69,67.06 35.31,67.06 35.56,66.8 38.86,66.8 38.86,66.04 30.73,66.04 30.48,66.29 27.69,66.29
  pour Top (rank 2): 43.18,59.56 43.18,51.94 45.97,51.94 45.97,59.56
  pour Bottom: 39.24,61.85 41.02,60.07 43.18,60.07 43.18,55.12 45.21,55.12 45.21,60.45 43.81,61.85
  pour Bottom: 23.75,63.5 43.05,63.5 43.18,63.37 43.18,61.47 23.24,61.47 23.24,63.5
5VIN  (via drill 0.33 pad 0.55)
  Bottom 0.203: C22.1 50.79,41.12 C39.2 52.58,39.33 v52.58,39.12 51.38,37.92 C22.1
  pour Top: 78.49,14.99 78.49,4.57 83.57,4.57 83.57,12.83 58.42,37.97 58.42,39.88 49.53,39.88 49.53,36.32 51.31,36.32 53.59,38.61 56.9,38.61 56.9,36.58
  pour Top: 72.52,6.99 83.57,6.99 83.57,0.38 64.9,0.38 64.9,4.95 66.42,4.95 66.42,2.03 72.52,2.03
5VOUT  (via drill 0.33 pad 0.55)  (1 unrouted)
  Top 0.203: P1.200 25.27,71.15 23.61,69.49 16.11,69.49 9.66,75.94 X2.1
  Bottom 0.203: R7.1 71.1,24.89 R4.1 68.33,27.91 v68.33,31.24 | C29.1 C28.1 35.23,72.58 33.88,71.23 32.49,71.23 31.14,72.58 C27.1 C30.1
  other vias: 62.23,27.94 62.99,28.7 63.75,26.42 67.56,30.48 66.29,31.75 67.06,32.51 26.42,72.39 39.37,72.39
  pour Top: 27.69,71.88 30.23,71.88 30.73,71.37 38.86,71.37 38.86,70.1 30.48,70.1 30.23,70.36 27.69,70.36
  pour Top: 7.37,76.2 42.93,76.2 42.93,71.12 28.19,71.12 24.64,67.56 24.64,23.37 24.89,23.11 49.78,23.11 49.78,12.45 50.8,11.43 53.09,11.43 54.1,10.41 54.1,7.87 54.36,7.62 61.34,7.62 61.34,4.83 53.85,4.83 52.07,6.6 52.07,9.14 51.56,9.65 49.28,9.65 48.01,10.92 48.01,21.34 21.84,21.34 21.84,67.06 7.37,67.06
  pour Top: 48.01,23.11 48.01,28.96 62.23,28.96 62.99,29.72 65.28,27.43 66.04,26.67 66.04,25.91 50.04,25.91 49.78,25.91 49.78,23.11
  pour Top: 65.41,31.62 76.2,42.42 95.76,42.42 95.76,39.62 77.72,39.62 67.56,29.46
  pour Bottom: 62.74,29.21 67.06,33.53 69.34,31.24 64.01,25.91 61.21,25.91 61.21,28.96 62.23,28.96 62.48,28.96
  pour Bottom: 23.62,73.41 42.93,73.41 42.93,71.12 23.62,71.12 23.11,71.12 23.11,73.41
  pour Top: 63.5,4.95 64.39,4.95 64.39,0.38 56.39,0.38 56.39,7.62 61.34,7.62 61.34,4.83 61.34,3.17 63.5,3.17
142
  Top 0.203: R3.2 56.53,67.37 57.56,66.34 58.76,66.34 IC1.142
D_N
  Top 0.203: P1.167 39.19,61.25 39.5,61.56 42.55,61.56 43.06,62.07 43.06,76.69 42.93,76.82 12.67,76.82 12,77.49 12,79.66 X2.2
D_P
  Top 0.203: X2.3 14.16,78.65 14.62,78.19 43.45,78.19 44.56,77.09 44.56,61.93 43.03,60.39 39.44,60.39 39.19,60.65 P1.165
FT_PD  (via drill 0.33 pad 0.55)
  Top 0.203: v81.79,70.1 81.57,70.33 IC1.47
  Bottom 0.203: LCDCONNECTOR.8 88.12,56.55 88.12,58.7 81.79,65.04 v81.79,70.1
GND  (via drill 0.33, 0.33 pad 0.55, 0.35)
  Top 0.203: J1.GND J1.P$4 92.77,15.1 v93.17,15.49 | v62.94,11.68 63,11.63 U$1.20 63,8.63 63.37,8.26 U$1.P$3 | v58.12,10.92 C21.2 55.11,8.6 v55.07,8.64 | v68.83,67.06 68.27,66.49 IC1.16 | v75.31,69.72 75.31,69.34 78.83,65.83 IC1.38 | v75.31,73.28 76.26,72.33 IC1.51 81.34,72.33 81.79,71.88 v82.04,71.88 v83.06,71.88 83.82,71.12 v84.33,71.12 v85.34,70.1 v86.36,69.09 | v75.31,76.83 77.98,76.83 78.47,77.33 IC1.61 81.64,77.33 v82.04,77.72 v83.57,77.72 v85.09,77.72 v86.36,77.72 v87.88,77.72 | v74.99,80.46 74.99,81.98 73.27,83.7 IC1.83 73.22,84.86 73.22,85.68 73.05,85.86 67.99,85.86 67.81,85.68 67.81,84.86 IC1.94 67.77,83.61 v70.99,80.39 | v62.87,80.39 61.27,81.99 IC1.107 61.27,86.73 57.65,90.35 FTDI.1 | v62.61,78.36 61.34,78.36 60.34,77.36 60.31,77.33 IC1.120 57.64,77.33 57.02,76.71 57.02,73.27 57.92,72.37 58.74,72.37 IC1.130 61.02,72.33 62.99,74.3 v62.87,74.3 | v26.67,56.64 28.98,56.64 P1.152 | v26.16,70.36 26.57,69.95 P1.196 30.76,69.95 31.06,69.65 P1.195 | IC1.31 75.8,63.31 75.8,62.24 75.41,61.85 v74.93,61.85 | v69.85,12.95 68.86,11.96 U$1.11 68.86,8.78 68.33,8.26 U$1.P$9 | v68.2,51.44 68.22,51.45 C3.2 C4.2 76.18,51.45 v76.2,51.44 | P1.188 26.94,67.55 26.92,67.56 26.8,67.44 26.8,65.91 26.92,65.79 29.05,65.79 P1.182 | P1.181 38.65,65.45 39.37,66.17 39.37,67.06 39.18,67.25 P1.187 | U$1.10 68.69,4.33 68.69,5.03 68,5.71 U$1.P$7 66.9,5.42 U$1.7 | U$1.1 63,5.2 62.99,5.21 63.5,5.71 U$1.P$1 | IC2.2 v53.72,60.58 | IC3.2 46.35,46.23 46.48,46.1 46.5,46.12 R15.2 | R16.1 48.89,59.06 v48.13,59.82
  Bottom 0.203: v58.12,10.92 59.64,10.92 60.4,11.68 v62.94,11.68 | R5.2 80.44,21.38 R9.2 R8.1 91.77,16.89 v93.17,15.49 93.17,38.48 | C36.2 48.02,33.86 C38.2 48.02,35.18 C22.2 48.02,40.66 C39.1 48.02,41.99 C35.2 48.02,47.47 C37.1 | C13.2 68.83,65.66 v68.83,67.06 | C11.2 75.31,69.28 v75.31,69.72 | C15.1 75.5,73.28 v75.31,73.28 | C5.1 76.14,76.83 v75.31,76.83 | C6.1 76.26,79.19 v74.99,80.46 C41.2 | C9.2 70.58,80.81 v70.99,80.39 | C17.2 66.56,80.76 v66.93,80.39 | C8.2 62.55,80.71 v62.87,80.39 | C10.2 62.08,78.36 v62.61,78.36 | C14.1 v62.86,74.29 | v62.86,74.29 v62.87,74.3 | v62.86,74.29 62.86,73.54 63.75,72.65 63.75,71.39 61.38,69.02 61.13,69.02 C7.1 | C33.2 C32.2 C31.2 C34.2 | C24.2 C23.2 C26.2 C25.2 | C30.2 C27.2 32.41,74.48 32.49,74.57 33.88,74.57 33.96,74.48 C28.2 C29.2 | R2.2 25.29,56.64 v26.67,56.64 | C42.2 79.19,93.23 81.42,93.23 J2.3 J2.5 | PROXIMITYSENSOR.1 55.07,8.26 v55.07,8.64 | 93.17,38.48 LCDCONNECTOR.19 | 93.17,38.48 93.17,38.64 LCDCONNECTOR.20 | C1.2 37.34,93.73 v37.21,93.85 | C16.2 84.26,80.46 v84.33,80.39
  other vias: 84.33,65.28 39.88,70.1 82.3,74.93 83.57,74.93 84.84,74.93 86.11,74.93 87.38,74.93 88.65,74.93 89.92,74.93 91.19,74.93 92.2,74.93 95.25,71.12 95.25,67.56 95.25,64.26 95.25,61.21 96.77,71.12 96.77,67.56 96.77,64.26 96.77,61.21 98.17,71.12 98.3,67.44 98.3,64.26 98.17,61.21 70.1,53.47 72.14,53.47 74.17,53.47 35.18,95.25 37.21,95.25 35.18,93.85 35.18,92.46 37.21,92.46 84.2,16.51 85.6,16.51 87,16.51 88.39,16.51 89.79,16.51 91.19,16.51 91.19,15.11 89.79,15.11 88.39,15.11 87,15.11 85.6,15.11 84.2,15.11 93.73,16.89 95.12,16.89 96.52,16.89 95.12,15.49 96.52,15.49 95.12,14.1 96.52,14.1 95.12,12.7 96.52,12.7 42.67,53.59 42.67,48.9 42.67,43.94 42.67,36.45 42.67,29.97 41.15,56.01 41.15,48.9 41.15,40.64 41.15,33.02 48.9,56.26 43.81,63.63 43.81,72.77 42.16,77.47 36.2,77.47 29.72,77.47 24.13,77.47 18.41,77.47 62.99,22.23 64.01,20.45 62.99,20.83 62.99,19.43 64.01,18.41 3.17,59.18 3.17,57.78 3.17,56.39 3.17,54.99 3.17,53.59 3.3,19.81 3.3,18.41 3.3,17.02 3.3,15.62 3.3,14.22 3.3,12.83 53.72,31.75 55.12,31.75 56.52,31.75 57.91,31.75 59.31,31.75 59.31,30.35 57.91,30.35 56.52,30.35 55.12,30.35 53.72,30.35 52.32,41.02
  pour Top (isolate 0.254, rank 5): 0,100 100,100 100,0 0,0
  pour Top: 29.21,19.81 37.34,19.81 37.34,7.37 29.46,7.37 29.21,7.37
  pour Top (rank 3): 23.88,61.72 43.18,61.72 43.18,23.62 23.88,23.62 23.62,23.88 23.62,61.47
  pour Bottom (isolate 0.254, rank 3): 0,0 0,100.08 100.08,100.08 100.08,0
N$1  (via drill 0.33 pad 0.55)
  Top 0.203: IC1.71 80.29,82.3 v84.33,82.3
  Bottom 0.203: v84.33,82.3 82.61,82.3 C16.1
N$2  (via drill 0.33)
  Top 0.203: v64.9,80.39 61.77,83.52 IC1.106
  Bottom 0.203: C17.1 64.66,80.63 v64.9,80.39
N$3
  Bottom 0.203: R7.2 75.32,24.89 C20.2
N$4  (via drill 0.33)
  Top 0.203: v68.15,11.94 68.2,11.88 U$1.12
  Bottom 0.203: v68.15,11.94 67.64,12.45 R6.2 68.47,17.14 C19.1
N$5
  Bottom 0.203: R6.1 68.72,20.95 C18.1
N$6  (via drill 0.33)
  Top 0.203: v74.63,23.88 v74.63,26.42 | v73.1,15.49 71.33,13.72 68.02,13.72 67.39,13.08 67.39,11.3 67.55,11.14 U$1.13
  Bottom 0.203: R5.1 C20.1 76.24,27.79 R4.2 73.26,27.79 v74.63,26.42 | v74.63,23.88 74.63,22.48 C18.2 C19.2 v73.1,15.5 v73.1,15.49
N$7
  Top 0.203: U$1.15 66.25,14.2 U$2.2
  pour Top (isolate 0.305, rank 2): 62.18,25.4 56.72,25.4 56.59,25.27 56.59,14.73 62.18,14.73
  pour Top (rank 2): 66.29,9.14 66.29,14.22 61.72,18.8 61.72,14.99 62.74,14.99 64.77,12.95 64.77,9.14
N$8
  Top 0.203: U$1.18 64.3,12.61 62.44,14.48 54.82,14.48 52.29,17 U$2.1
  pour Top (isolate 0.305, rank 3): 50.5,25.4 56.34,25.4 56.34,14.73 50.37,14.73 50.37,25.27
  pour Top: 63.5,12.19 63.5,8.89 64.52,8.89 64.52,12.7 62.74,14.48 56.39,14.48 56.13,14.73 56.13,14.99 50.55,14.99 50.55,12.95 62.74,12.95
N$9  (via drill 0.33)
  Top 0.203: U$1.9 v68.2,2.54
  Bottom 0.203: v68.2,2.54 68.96,2.54 71.25,4.83 71.25,10.16 75.31,14.22 76.96,14.22 78.5,15.77 R8.2
N$10  (via drill 0.33)
  Top 0.203: U$1.8 67.55,2.83 67.54,2.81 67.54,2.79 v67.29,2.54 | v77.09,13.57 v77.09,15.37
  Bottom 0.203: R9.1 77.17,20 77.17,15.45 v77.09,15.37 | v67.29,2.54 67.54,2.29 67.54,2.27 67.93,1.88 69.57,1.88 71.88,4.19 71.88,9.91 75.56,13.59 77.07,13.59 v77.09,13.57
N$11
  Top 0.203: IC3.4 47.3,54.41 R14.2
N$12
  Top 0.203: D6.C 49.16,58.37 R16.2
N$13
  Top 0.203: R17.2 47.04,71.74 D5.C
N$14  (via drill 0.35)
  Top 0.203: IC2.4 55.99,64.37 v56.01,64.39
  Bottom 0.203: v56.01,64.39 55.99,64.41 R12.2
N$15
  Top 0.203: R18.2 76.66,8.85 D1.C
N$16
  Top 0.203: D4.C 44.81,25.33 R19.2
N$17
  Top 0.203: D3.C R20.2
N$18
  Top 0.203: D2.C R21.2
OSC_IN
  Top 0.203: IC1.23 71.77,62.12 70.61,60.96 68.71,60.96 67.31,59.56 25MHZ_OSC.1 66.52,57.37 C3.1
OSC_OUT
  Top 0.203: IC1.24 72.27,62.1 73.41,60.96 75.56,60.96 76.96,59.56 25MHZ_OSC.2 77.88,57.25 C4.1
QIO0
  Top 0.203: LCDCONNECTOR.5 94.49,57.57 94.49,74.17 92.83,75.83 IC1.58
QIO1
  Top 0.203: IC1.59 93.85,76.33 96.01,74.17 96.01,56.39 94.87,55.24 94.74,55.12 92.96,55.12 92.2,55.88 92.2,57.66 90.9,58.96 LCDCONNECTOR.4
QIO2
  Top 0.203: LCDCONNECTOR.11 95.33,48.8 97.51,50.97 97.51,74.49 95.17,76.83 IC1.60
QIO3
  Top 0.203: IC1.63 81.53,78.33 81.66,78.45 95.93,78.45 99.02,75.36 99.02,50.38 96.17,47.54 92.05,47.54 LCDCONNECTOR.12
QSPI_CS  (via drill 0.33)
  Top 0.203: LCDCONNECTOR.6 83.31,56.42 79.03,60.7 79.03,64.83 74.08,69.78 69.11,69.78 67.54,68.2 v64.77,68.2 | IC1.112 60.75,81.33 64.74,77.34 v64.77,77.34
  Bottom 0.203: v64.77,77.34 v64.77,68.2
QSPICLK
  Top 0.203: IC1.48 82.83,70.83 87.12,66.53 87.12,62.23 89.15,60.2 92.2,60.2 93.33,59.07 LCDCONNECTOR.3
RESET  (via drill 0.33 pad 0.55)
  Top 0.203: IC1.25 72.8,63.37 72.8,64.18 71.62,65.36 v71.62,69.13 | J2.10 85.09,98.17 51.23,98.17 S1.3
  Bottom 0.203: 86.38,91.3 88.88,93.81 88.88,95.38 88,96.27 J2.10 | 86.38,91.3 78.44,83.36 72.34,83.36 71.75,82.77 71.75,69.25 v71.62,69.13 | S1.3 42.16,91.85 42.16,93.66 C1.1 | R11.2 85.6,92.08 86.38,91.3
RUN  (via drill 0.33 pad 0.55)
  Top 0.203: P1.177 39.14,64.25 40,65.11 v40,66 | v51,70 51.82,69.18 51.82,68.07 52.58,67.31 53.94,67.31 R3.1
  Bottom 0.203: v51,70 51,69.11 47.89,66 v40,66
RUN_5V  (via drill 0.33)
  Top 0.203: IC1.3 61.77,47.07 v61.85,46.99 | R10.2 63.43,24.57 v63.37,24.51
  Bottom 0.203: v61.85,46.99 61.85,28.48 61.58,28.21 61.58,26.3 v63.37,24.51
RUN_5V_MODULE
  Top 0.203: R10.1 64.9,17.14 66.93,15.11 66.93,9.83 U$1.14
SENSOR_UART  (via drill 0.33 pad 0.55)
  Top 0.203: v64,60 65,60 67,62 69,62 69.27,62.27 IC1.18
  Bottom 0.203: PROXIMITYSENSOR.3 45.73,47.73 50,52 59.95,52 62.09,54.14 62.09,58.09 v64,60
SWCLK  (via drill 0.33 pad 0.55)
  Top 0.203: v57,83 57.17,82.83 IC1.109
  Bottom 0.203: J2.4 83.19,98.03 76.94,98.03 74.99,96.08 74.99,91.07 71.92,88 59,88 57,86 v57,83
SWDIO  (via drill 0.33 pad 0.55)
  Top 0.203: v62.22,86.47 62.26,86.47 62.27,86.47 IC1.105
  Bottom 0.203: J2.2 81.92,97 77,97 76,96 76,91 72.22,87.22 62.96,87.22 v62.22,86.47
SWO  (via drill 0.33 pad 0.55)
  Top 0.203: v57,71 57.17,70.83 IC1.133
  Bottom 0.203: J2.6 84.45,97.55 83.12,98.88 75.88,98.88 74,97 74,91 72,89 58,89 56,87 56,71 v57,71
UART5_RX  (via drill 0.33 pad 0.55)
  Top 0.203: P1.51 38.69,26.45 41.91,29.67 41.91,57.4 v45.97,61.47 | v54.86,70.61 54.86,77.72 56.47,79.33 IC1.116
  Bottom 0.203: v45.97,61.47 54.86,70.36 v54.86,70.61
UART5_TX  (via drill 0.33 pad 0.55)
  Top 0.203: IC1.113 54.86,80.83 v54.86,80.77 | P1.53 37.35,27.12 38.51,27.12 40.39,29 40.39,57.02 45.97,62.61 v45.97,64.01
  Bottom 0.203: v45.97,64.01 46.1,63.88 47.12,63.88 54.86,71.63 v54.86,80.77
USART1_RX
  Top 0.203: FTDI.4 63.77,93.5 IC1.102
USART1_TX
  Top 0.203: FTDI.5 67.81,92.81 64.27,89.27 IC1.101
USB_OTGID  (via drill 0.33)
  Top 0.203: v26.8,61.47 29.01,61.47 P1.168
  Bottom 0.203: R2.1 26.05,61.47 v26.8,61.47
VDD  (via drill 0.33, 0.33 pad 0.55)
  Top 0.203: v52.83,44.7 52.83,43.05 | v70.74,67.69 68.77,65.72 IC1.17 | v72.77,67.44 75.27,64.94 IC1.30 | v75.31,71.5 76.32,70.49 76.32,69.09 79.09,66.33 IC1.39 | v75.31,75.06 77.54,72.83 IC1.52 84.65,72.83 90.17,67.31 90.17,64.66 LCDCONNECTOR.1 | v75.31,78.61 76.1,77.83 IC1.62 | v78.11,82.55 78.38,82.83 IC1.72 80.26,88.91 77.22,91.95 v77.22,95 | v73.03,80.39 72.77,80.65 IC1.84 | v68.96,80.39 67.27,82.08 IC1.95 | IC1.108 60.66,84.71 v58.8,84.71 58.8,85.2 55,89 55,95 57,97 60.73,97 FTDI.3 | v62.87,76.33 62.37,76.83 IC1.121 | v62.87,72.26 62.43,71.83 IC1.131 | v58.93,63.5 58.93,65.18 IC1.144 | 52.83,43.05 47.37,43.05 v46.99,42.67 | 52.83,43.05 54.1,41.78 U1.4 | v80.39,92.08 81.92,93.6 J2.1
  Bottom 0.203: C37.2 50.58,44.94 C35.1 50.81,44.7 v52.83,44.7 | v70.74,67.69 70.79,67.64 C13.1 FERRITE_BEAD.1 73,67.21 v72.77,67.44 | C11.1 75.31,71.18 v75.31,71.5 | C15.2 75.63,75.06 v75.31,75.06 | C5.2 76.26,78.61 v75.31,78.61 | C6.2 78.11,81.21 v78.11,82.55 | C41.1 73.09,80.46 v73.03,80.39 | C9.1 68.68,80.67 v68.96,80.39 | v58.8,84.71 60.65,82.86 C8.1 61.02,82.23 61.59,81.67 61.59,80.7 62.58,79.71 63.55,79.71 v64.01,79.25 64.01,77.98 63.5,77.47 63.43,77.54 C10.1 62.21,76.33 v62.87,76.33 | C14.2 61.13,72.26 v62.87,72.26 | C7.2 61,65.57 v58.93,63.5 | C42.1 79.03,95.29 | 79.03,95.29 79.33,95 J2.1 | v77.22,95 78.74,95 79.03,95.29 | PROXIMITYSENSOR.2 48.27,28.42 46.3,30.39 46.3,41.1 46.99,41.78 v46.99,42.67 | v66.8,67.06 66.74,66.99 C12.1 | R11.1 v80.39,92.08
  pour Top: 58.8,84.71 58.8,63.5 80.14,63.5 80.14,85.09 58.8,85.09
  pour Top (rank 2): 56.77,41.15 53.34,41.15 51.56,42.93 49.66,42.93 49.66,53.21 51.05,54.61 51.05,63.04 56.01,63.04 56.01,66.04 60.33,66.04 60.33,61.47 56.9,61.47 56.9,57.78 51.69,52.58 51.69,45.85 53.34,45.85 54.1,45.09 54.1,42.55 56.77,42.55
VDD_MOSFET  (via drill 0.35)
  Top 0.203: IC2.3 54.67,60.9 v55.24,60.33 | IC1.1 60.77,61.63 v60.61,61.47
  Bottom 0.203: v55.24,60.33 55.26,60.31 R13.1 59.45,60.31 v60.61,61.47
VDD_PI  (via drill 0.33, 0.33 pad 0.55)
  Top 0.203: P1.193 39.41,69.05 v39.88,68.58 | P1.192 27.77,68.75 27.69,68.83 27.56,68.83 | v26.16,68.83 27.56,68.83 | 27.56,68.83 28.07,69.35 P1.194
  Bottom 0.203: C26.1 C25.1 40.83,67.63 v39.88,68.58 | C23.1 C24.1 24.96,67.63 v26.16,68.83
  other vias: 45.34,68.71 46.86,68.71 48.39,68.71 45.34,67.69 46.86,67.69 48.39,67.69
  pour Top: 27.43,68.58 35.81,68.58 36.07,68.33 38.86,68.33 38.86,69.09 30.99,69.09 30.73,69.34 27.43,69.34
  pour Top (rank 2): 44.58,69.47 49.53,69.47 53.85,65.15 53.85,63.45 49.91,63.45 49.91,66.93 44.58,66.93
  pour Bottom: 23.24,68.58 43.69,68.58 44.58,69.47 49.53,69.47 49.53,66.93 44.2,66.93 43.69,66.42 23.24,66.42
VDDA  (via drill 0.33)
  Top 0.203: v75.31,67.44 75.82,66.93 75.82,65.15 76.77,64.2 IC1.33 76.77,62.52 76.99,62.3 77.48,62.3 v77.72,62.05
  Bottom 0.203: v75.31,67.44 75.59,67.15 FERRITE_BEAD.2 | R1.1 79.61,62.98 78.74,62.1 77.77,62.1 v77.72,62.05
VREF  (via drill 0.33)
  Top 0.203: v76.45,61.85 76.27,62.03 IC1.32
  Bottom 0.203: R1.2 80.41,61.85 79.06,61.85 78.62,61.41 77.46,61.41 77.01,61.85 v76.45,61.85

### Text on the board
tPlace: JTAG PORT | FTDI | RST | USB PORT | Two Things | 3.3V PI ON | 1.8V PI ON | LCD CONNECTOR | Microcontroller ON | 3.3V AND 1.8V LDO | INDUCTOR | 1.8V LDO ON | 5V OUT ON | RASPBERRY PI COMPUTE MODULE | Team 18: Parking Spot Finder / / / Damini Rhijwani / Noureldin Hendy / Tania Chakraborty / Richard Rao | BUCK BOOST REGULATOR | Power ON | VIN